# EAGLE schematic GateInterface (EAGLE 9.5.2)
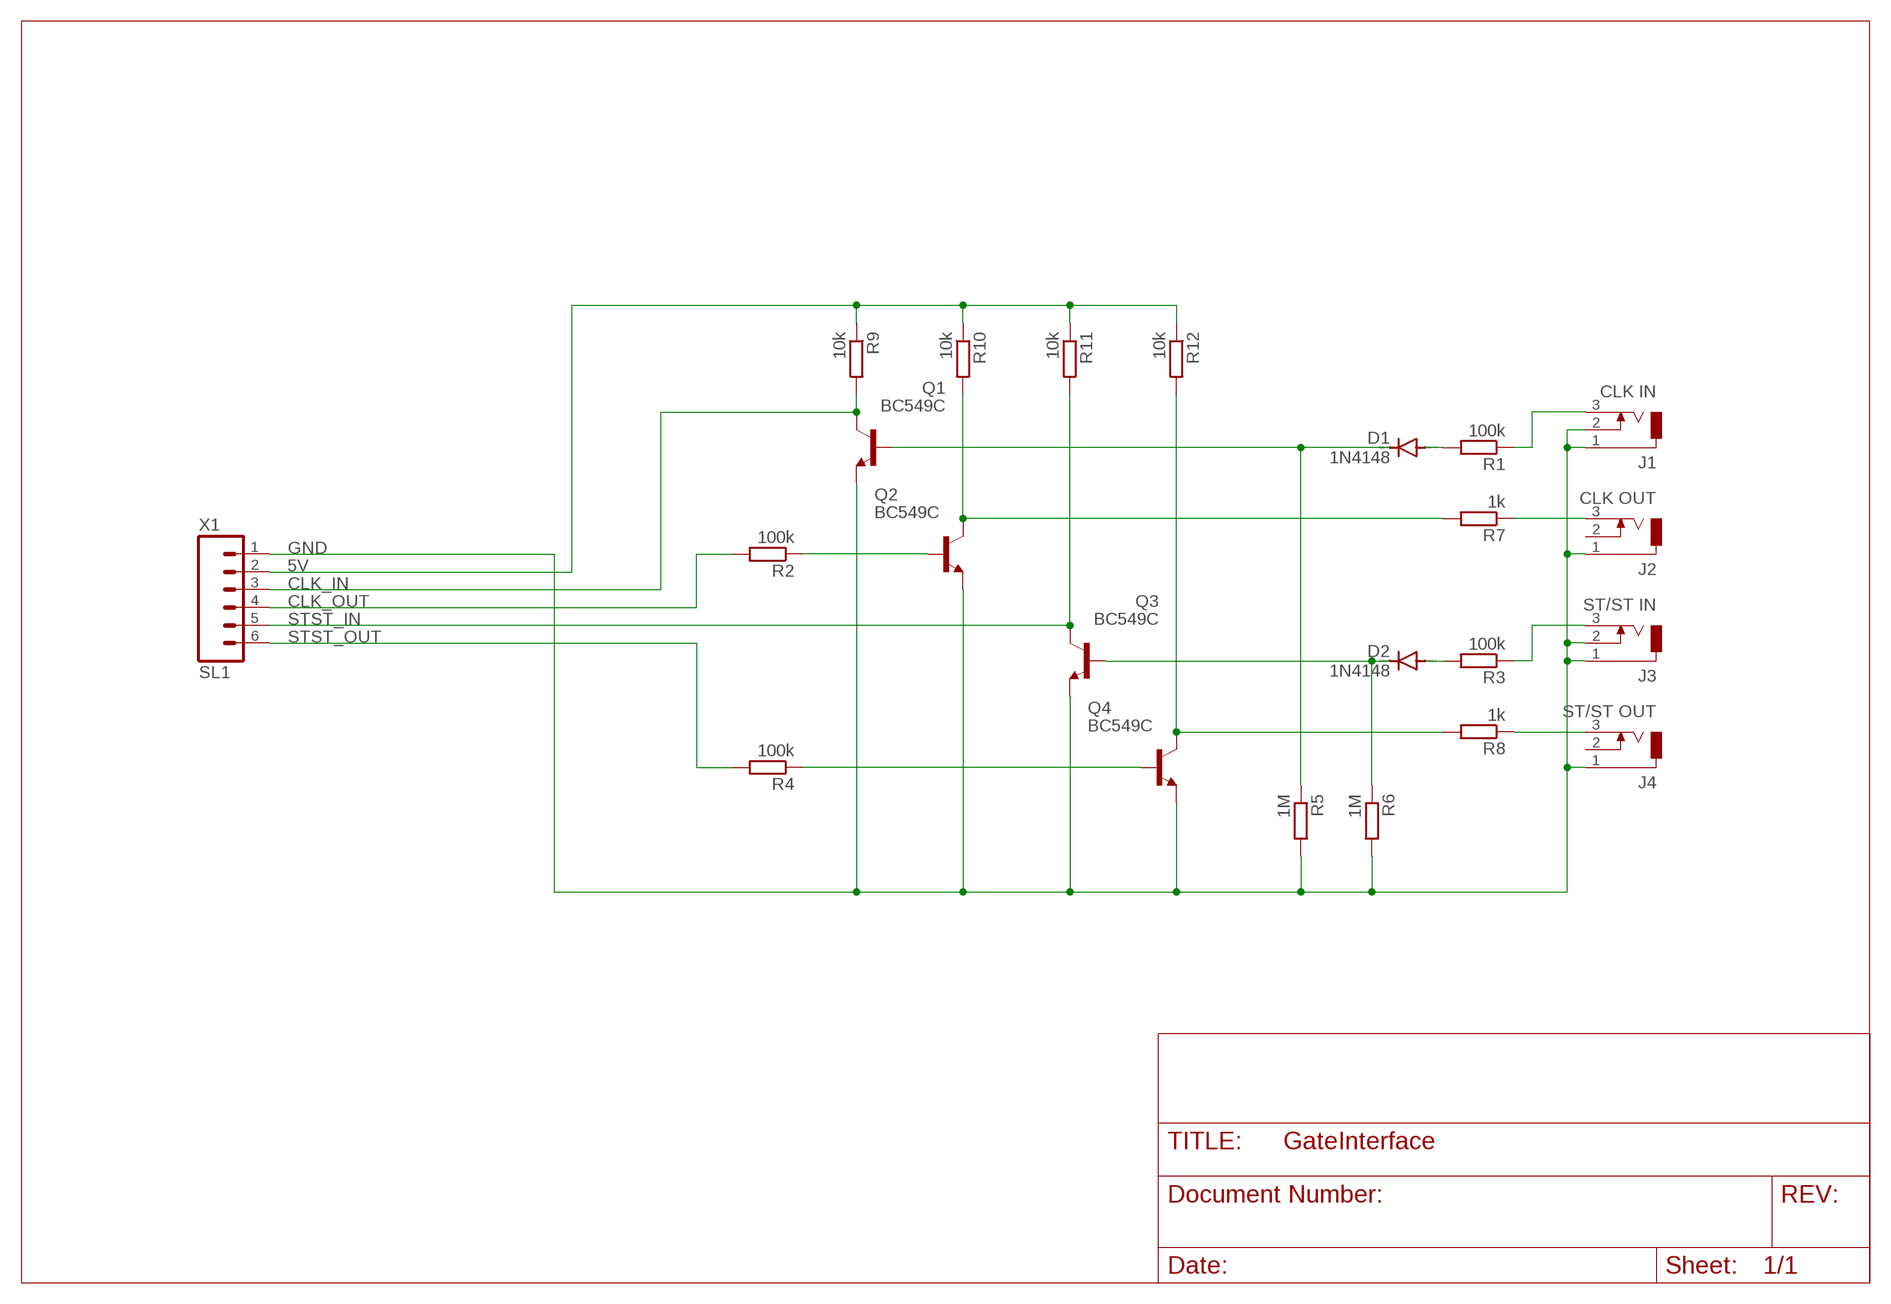
[diagram p0: schematic, sheet 1]

## Parts
D1  1N4148  1N4148DO35-10  [DO35-10]
D2  1N4148  1N4148DO35-10  [DO35-10]
J1  CLK IN  DCJ0202  [DCJ0202]
J2  CLK OUT  DCJ0202  [DCJ0202]
J3  ST/ST IN  DCJ0202  [DCJ0202]
J4  ST/ST OUT  DCJ0202  [DCJ0202]
Q1  BC549C  [TO92-EBC]
Q2  BC549C  [TO92-EBC]
Q3  BC549C  [TO92-EBC]
Q4  BC549C  [TO92-EBC]
R1  100k  R-EU_0207/10  [0207/10]
R2  100k  R-EU_0207/10  [0207/10]
R3  100k  R-EU_0207/10  [0207/10]
R4  100k  R-EU_0207/10  [0207/10]
R5  1M  R-EU_0207/10  [0207/10]
R6  1M  R-EU_0207/10  [0207/10]
R7  1k  R-EU_0207/10  [0207/10]
R8  1k  R-EU_0207/10  [0207/10]
R9  10k  R-EU_0207/10  [0207/10]
R10  10k  R-EU_0207/10  [0207/10]
R11  10k  R-EU_0207/10  [0207/10]
R12  10k  R-EU_0207/10  [0207/10]
SL1  X1  M06  [06P]

## Nets
5V: R9.1 R10.1 R11.1 R12.1 SL1.2
CLK_IN: Q1.C R9.2 SL1.3
CLK_OUT: R2.2 SL1.4
GND: J1.1 J1.2 J2.1 J3.1 J3.2 J4.1 Q1.E Q2.E Q3.E Q4.E R5.2 R6.2 SL1.1
N$1: J1.3 R1.1
N$2: J4.3 R8.1
N$3: J3.3 R3.1
N$5: D1.A R1.2
N$6: D1.C Q1.B R5.1
N$7: D2.C Q3.B R6.1
N$8: D2.A R3.2
N$11: Q2.B R2.1
N$12: Q4.B R4.1
N$14: Q2.C R7.2 R10.2
N$16: Q4.C R8.2 R12.2
N$17: J2.3 R7.1
STST_IN: Q3.C R11.2 SL1.5
STST_OUT: R4.2 SL1.6
Unconnected: J2.2 J4.2

## Library data of the parts
D1 D2 = diode:1N4148: DIODE high speed (Philips)
J1-J4 = con-jack:DCJ0202: DC POWER JACK Source: DCJ0202.pdf; OC_FARNELL: unknown; OC_NEWARK: unknown
Q1-Q4 = transistor-npn:BC549*: NPN Transistor
R1-R12 = rcl:R-EU_: RESISTOR, European symbol; SPICEPREFIX: R
SL1 = con-amp-quick:M06: AMP QUICK CONNECTOR; OC_FARNELL: unknown; OC_NEWARK: unknown